# EAGLE schematic uvi-2.1 (EAGLE 7.3.0)
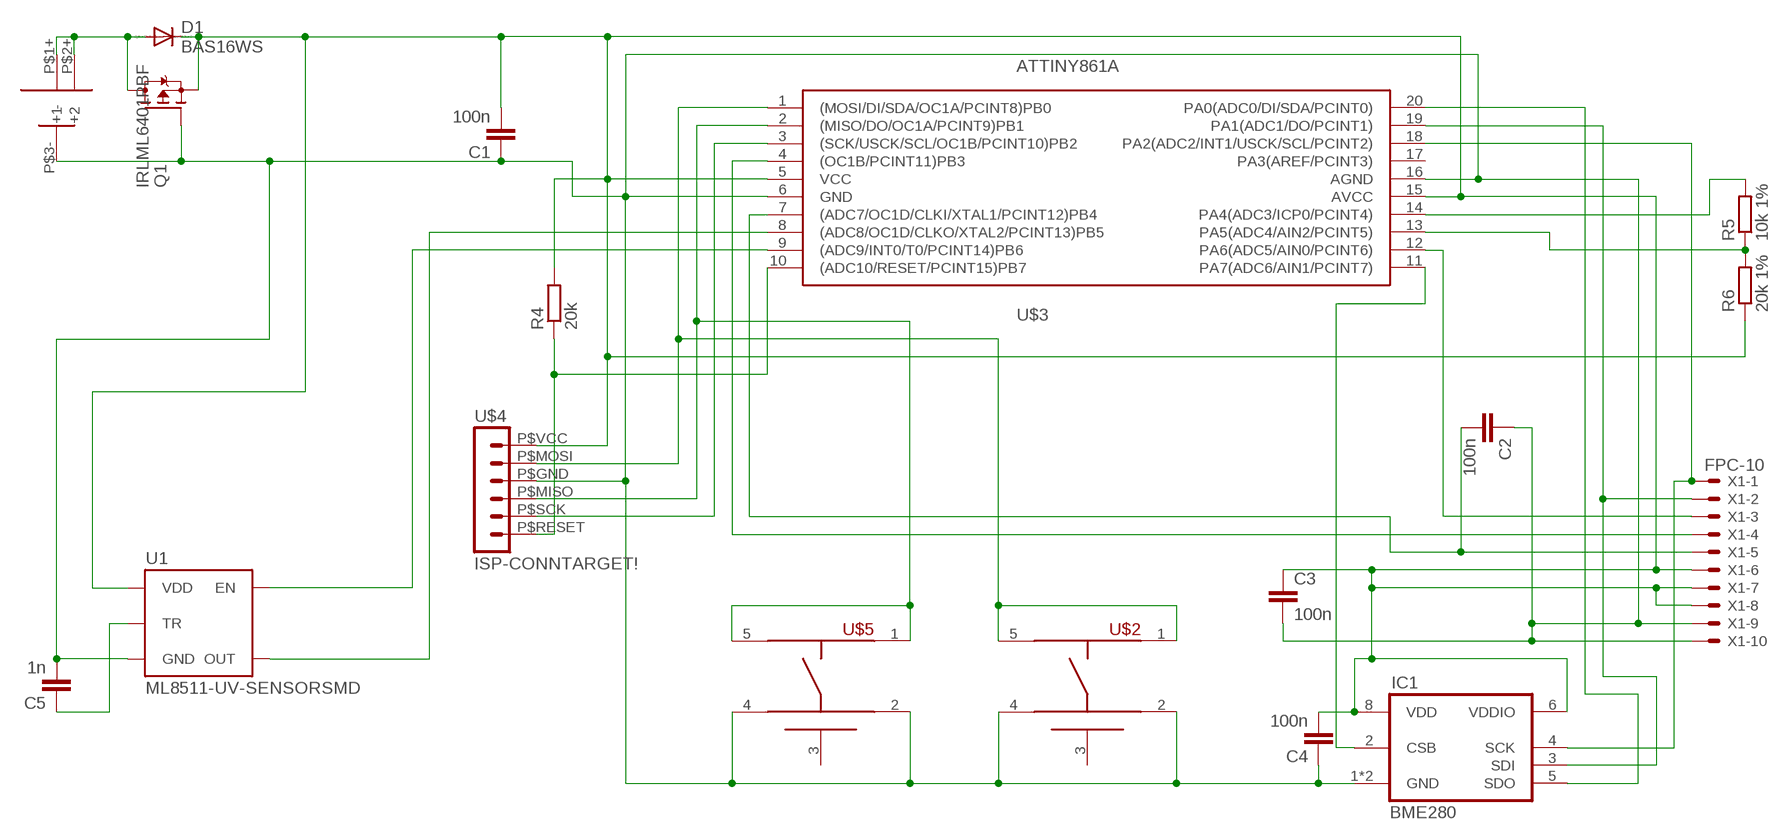
[diagram p0: schematic, sheet 1]

## Parts
C1  100n  C-EUC0805  [C0805]
C2  100n  C-EUC0805  [C0805]
C3  100n  C-EUC0805  [C0805]
C4  100n  C-EUC0805  [C0805]
C5  1n  C-EUC0805  [C0805]
D1  BAS16WS  [SOD323-W]
IC1  BME280  [BMP280]
Q1  IRLML6401PBF  [SOT23]
R4  20k  R-EU_R0805  [R0805]
R5  10k 1%  R-EU_R0805  [R0805]
R6  20k 1%  R-EU_R0805  [R0805]
U1  ML8511-UV-SENSORSMD  [ML8511]
U$1  CR2016  [BAT-HLD-002]
U$2  KMSXXXG  [C&K-KMS-SWITCH]
U$3  ATTINY861A  [TSSOP20]
U$4  ISP-CONNTARGET!  [ISP-TARGET]
U$5  KMSXXXG  [C&K-KMS-SWITCH]
X1  FPC-10  [FPC-10-BTM]

## Nets
GND: C1.1 C2.1 C3.2 C4.1 C5.2 IC1.1(GND) IC1.7(GND) Q1.1(G) U1.5(GND) U$1.P$3-(-) U$2.2 U$2.4 U$3.6(GND) U$3.16(AGND) U$4.P$GND(GND) U$5.2 U$5.4 X1.P$9 X1.P$10
N$1: D1.A Q1.3(D) U$1.P$1+(+1) U$1.P$2+(+2)
N$2: R4.1 U$3.10((ADC10/RESET/PCINT15)PB7) U$4.P$RESET(RESET)
N$3: IC1.5(SDO) U$3.20(PA0(ADC0/DI/SDA/PCINT0))
N$4: R5.2 U$3.14(PA4(ADC3/ICP0/PCINT4))
N$5: IC1.4(SCK) U$3.18(PA2(ADC2/INT1/USCK/SCL/PCINT2)) X1.P$1
N$6: C5.1 U1.10(TR)
N$7: IC1.3(SDI) U$3.19(PA1(ADC1/DO/PCINT1)) X1.P$2
N$8: U1.8(OUT) U$3.8((ADC8/OC1D/CLKO/XTAL2/PCINT13)PB5)
N$9: C2.2 U$3.7((ADC7/OC1D/CLKI/XTAL1/PCINT12)PB4) X1.P$5
N$11: U$3.2((MISO/DO/OC1A/PCINT9)PB1) U$4.P$MISO(MISO) U$5.1 U$5.5
N$13: U$3.3((SCK/USCK/SCL/OC1B/PCINT10)PB2) U$4.P$SCK(SCK)
N$14: IC1.2(CSB) U$3.11(PA7(ADC6/AIN1/PCINT7))
N$15: U$3.4((OC1B/PCINT11)PB3) X1.P$4
N$16: U$3.12(PA6(ADC5/AIN0/PCINT6)) X1.P$3
N$20: U$2.1 U$2.5 U$3.1((MOSI/DI/SDA/OC1A/PCINT8)PB0) U$4.P$MOSI(MOSI)
N$21: U1.4(EN) U$3.9((ADC9/INT0/T0/PCINT14)PB6)
N$22: R5.1 R6.2 U$3.13(PA5(ADC4/AIN2/PCINT5))
VCC: C1.2 C3.1 C4.2 D1.C IC1.6(VDDIO) IC1.8(VDD) Q1.2(S) R4.2 R6.1 U1.7(VDD) U$3.5(VCC) U$3.15(AVCC) U$4.P$VCC(VCC) X1.P$6 X1.P$7 X1.P$8
Unconnected: U$2.3 U$3.17(PA3(AREF/PCINT3)) U$5.3

## Library data of the parts
C1-C5 = rcl:C-EU: CAPACITOR, European symbol
D1 = _myLIB:BAS16WS: DIODE general purpose rectifier, 1 A
IC1 = bosch-bmp280:BME280: The BMP280 is an absolute barometric pressure sensor especially designed for mobile applications. The sensor module is housed in an extremely compact 8-pin metal-lid LGA package with a footprint of only 2.0 × 2.5 mm2 and 0.95 mm package height. Its small dimensions and its low power consumption of 2.7 μA @1Hz allow the implementation in battery driven devices such as mobile phones, GPS modules or watches. The library has been designed by Richard Magdycz <https://www.facebook.com/groups/eaglecadsoftUK>
Q1 = _myLIB:IRLML6401PBF
R4-R6 = rcl:R-EU_: RESISTOR, European symbol
U1 = SparkFun-Sensors:ML8511-UV-SENSOR; PROD_ID: IC-11927
U$1 = _myLIB:CR2016
U$2 U$5 = domestichacks:KMSXXXG: C&K KMS Series Microminiature SMT Side Actuated KMS221G KMS223G KMS231G KMS233G
U$3 = _myLIB:ATTINY861A
U$4 = _myLIB:ISP-CONN: 6 x 0.1 inch Header 40x1 0.1inch Male Breakaway header can be used. - 4UCON 00834 <http://www.4uconnector.com/online/SearchPro.asp?FormName=ProSearch&FormAction=search&s_GroupNo=&s_keyword=00834> For female part, if possible use 6 x 1 without breaking.
X1 = _myLIB:FPC-10: FPC Connector ZIF for SMT 0.5mm Source: http://www.farnell.com/datasheets/73044.pdf [DWG. NO. (Sheet 1 OF 2) SD-52746-**17]